# Altium schematic sheet CON_USBB_RA.SchDoc: USB 2.0 Type B Connector
size A4; Organization: Altium Limited.; Address1: Level 3, 12a Rodborough Rd; Address2: Frenchs Forest 2086; Address3: NSW; Address4: AUSTRALIA; SheetNumber: 1; SheetTotal: 100
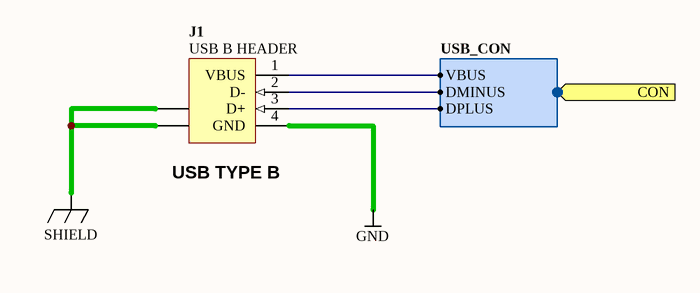
[diagram p0: CON_USBB_RA.SchDoc]

## Parts
J1  USB B HEADER  [440119]

## Ports
CON (harness USB_CON)

## Harnesses
USB_CON: VBUS, DMINUS, DPLUS

## Nets
GND: J1.4(GND)
SHIELD: J1.5(SHLD) J1.6(SHLD)
NetJ1_1: J1.1(VBUS) ; port CON.VBUS
NetJ1_2: J1.2(D-) ; port CON.DMINUS
NetJ1_3: J1.3(D+) ; port CON.DPLUS

## Notes on the sheet
- (near J1) USB TYPE B
- Sheet Title
- Project Title
- Size:
- Date:
- A4
- Assy:
- Time:
- Revision:
- Sheet
- of
- File:

## Library data of the parts
J1 = D-300-0000: Connector, USB B Type, Right Angle, Thru Hole, White; Max Current: mA; Category: Connector; Connector type: Header; Mounting Technology: Through-Hole; Pin Count: 4; Status: Production